# Altium schematic sheet 03_POWER-DISCRETE.SchDoc: =title
size A1; Author: kang jin; Engineer: kang jin; Organization: 六零加智能科技; Address4: www.nidone.com.cn; Revision: 1.0
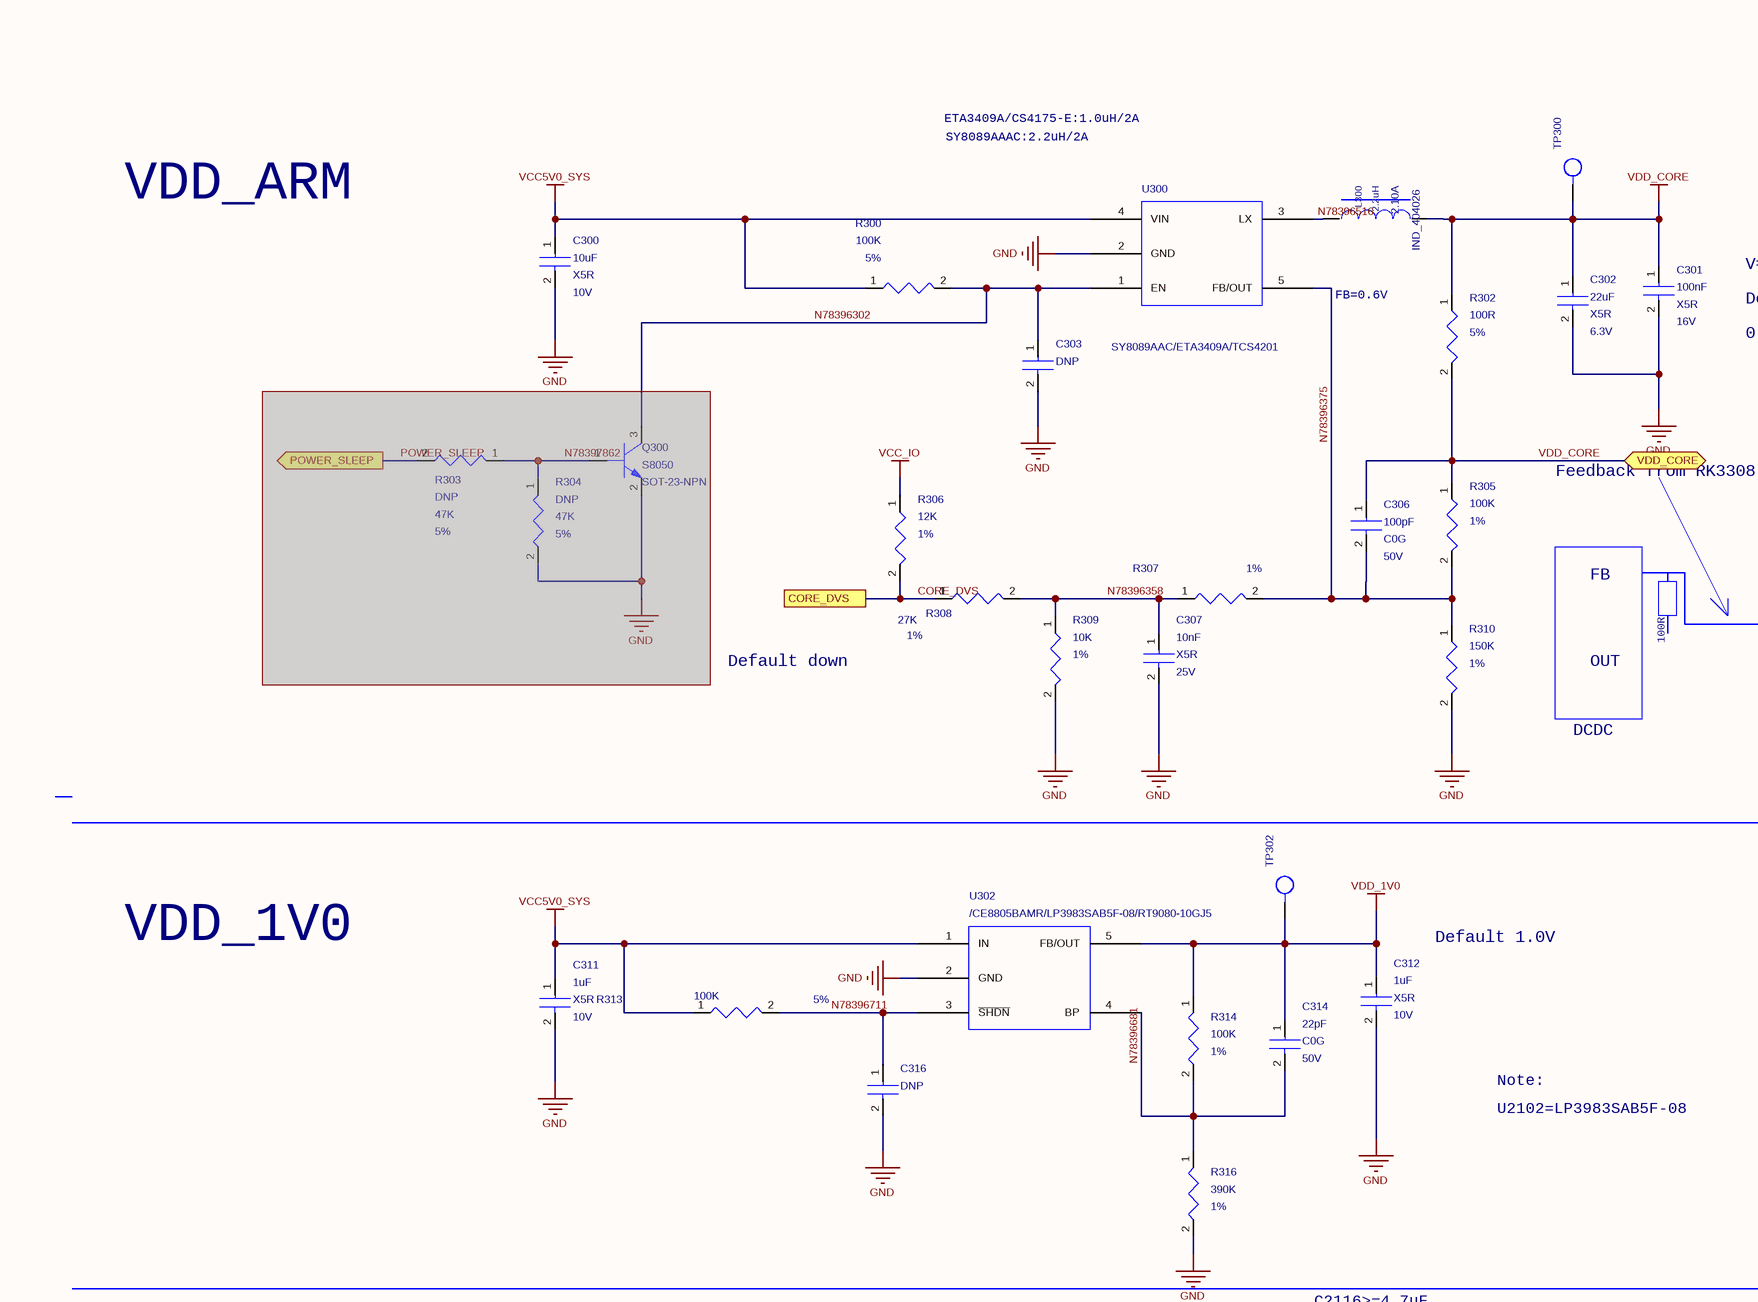
[diagram p0: 03_POWER-DISCRETE.SchDoc, top left]
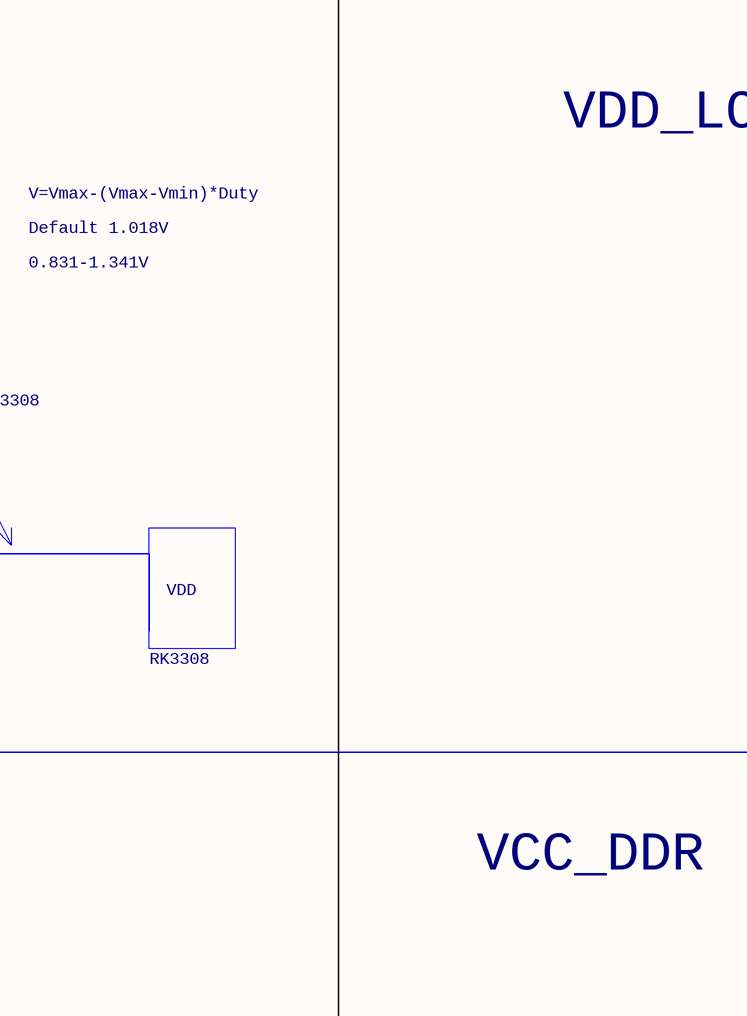
[diagram p1: 03_POWER-DISCRETE.SchDoc, top middle]
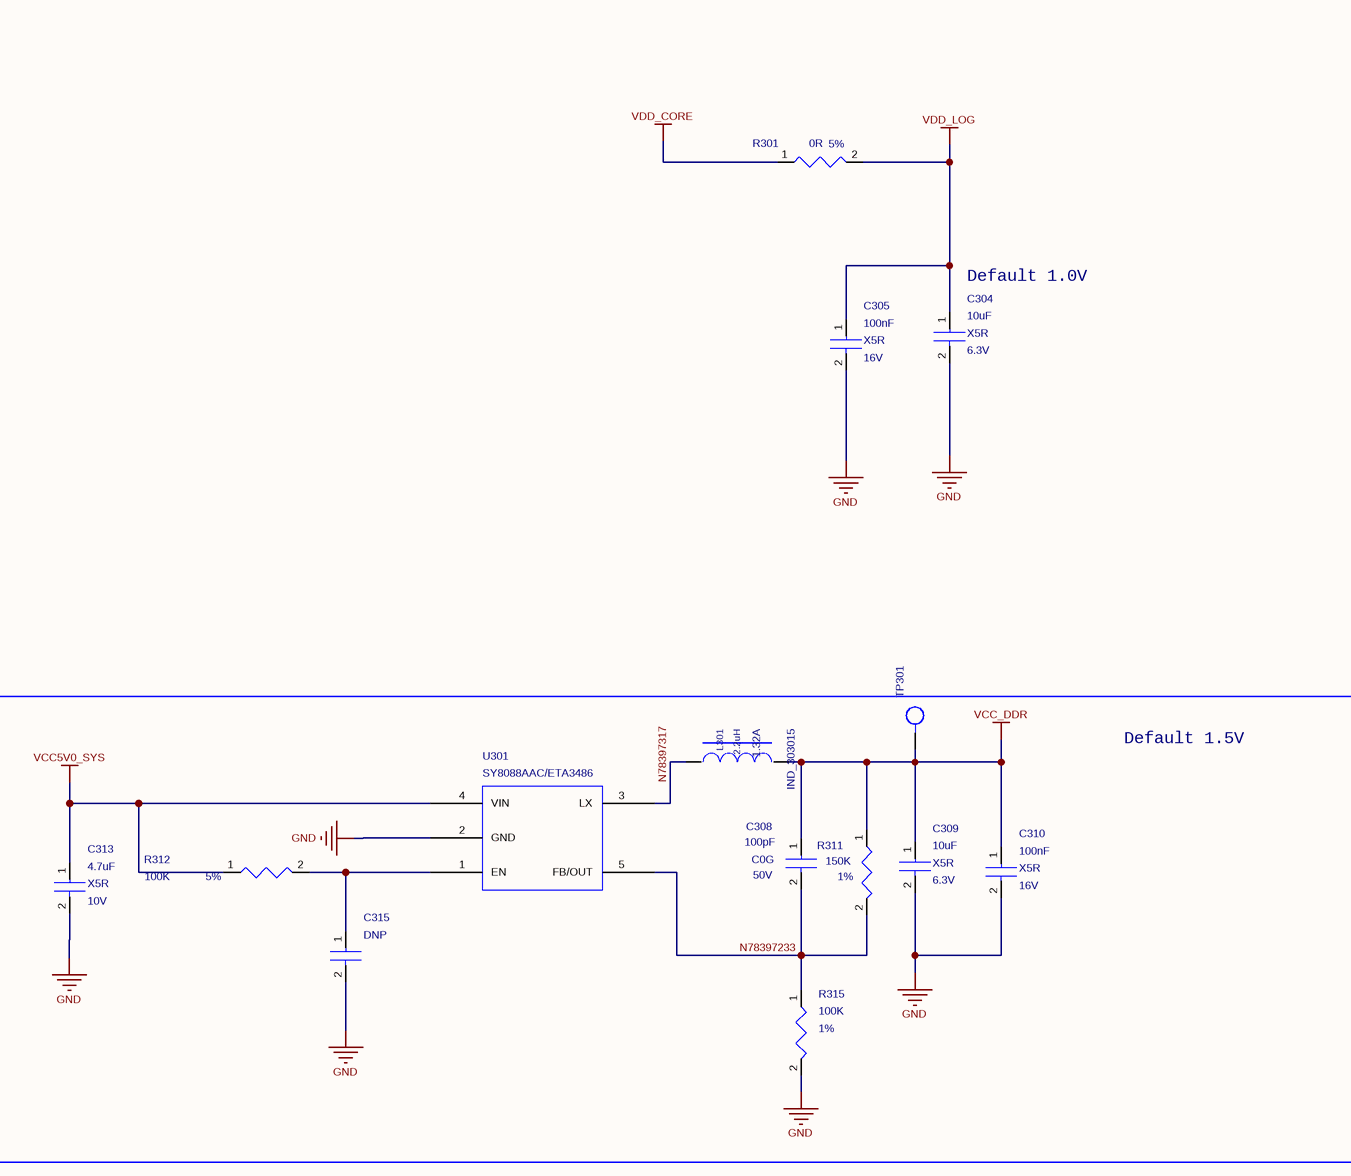
[diagram p2: 03_POWER-DISCRETE.SchDoc, top right]
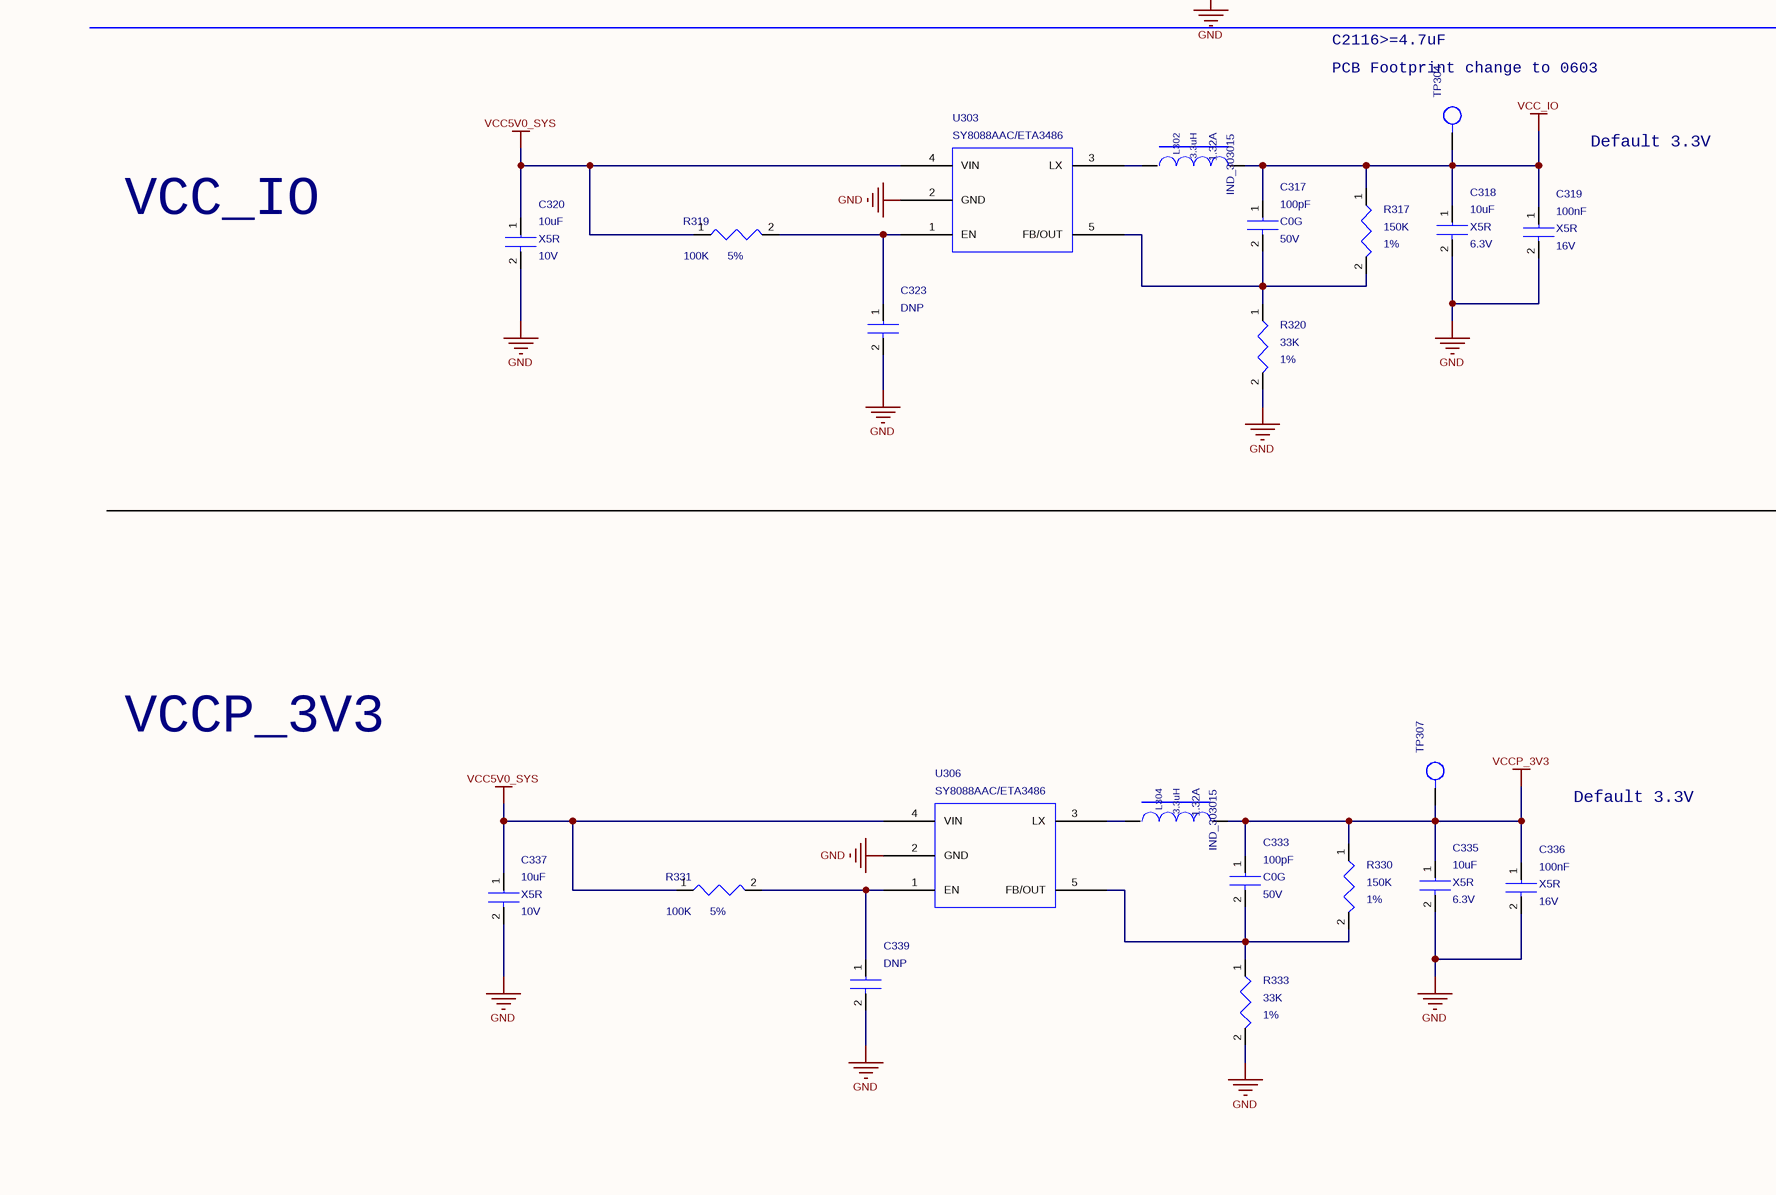
[diagram p3: 03_POWER-DISCRETE.SchDoc, centre left]
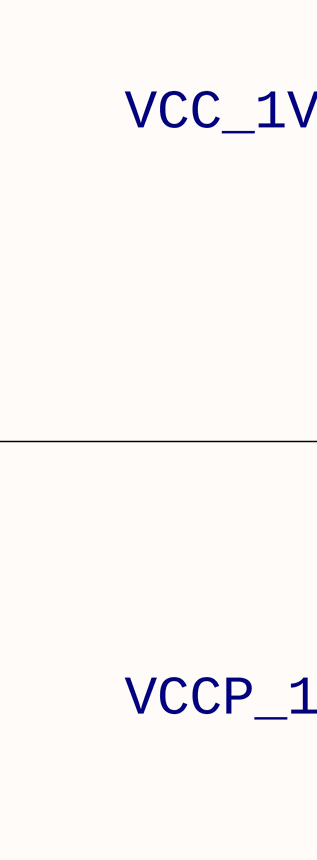
[diagram p4: 03_POWER-DISCRETE.SchDoc, centre middle]
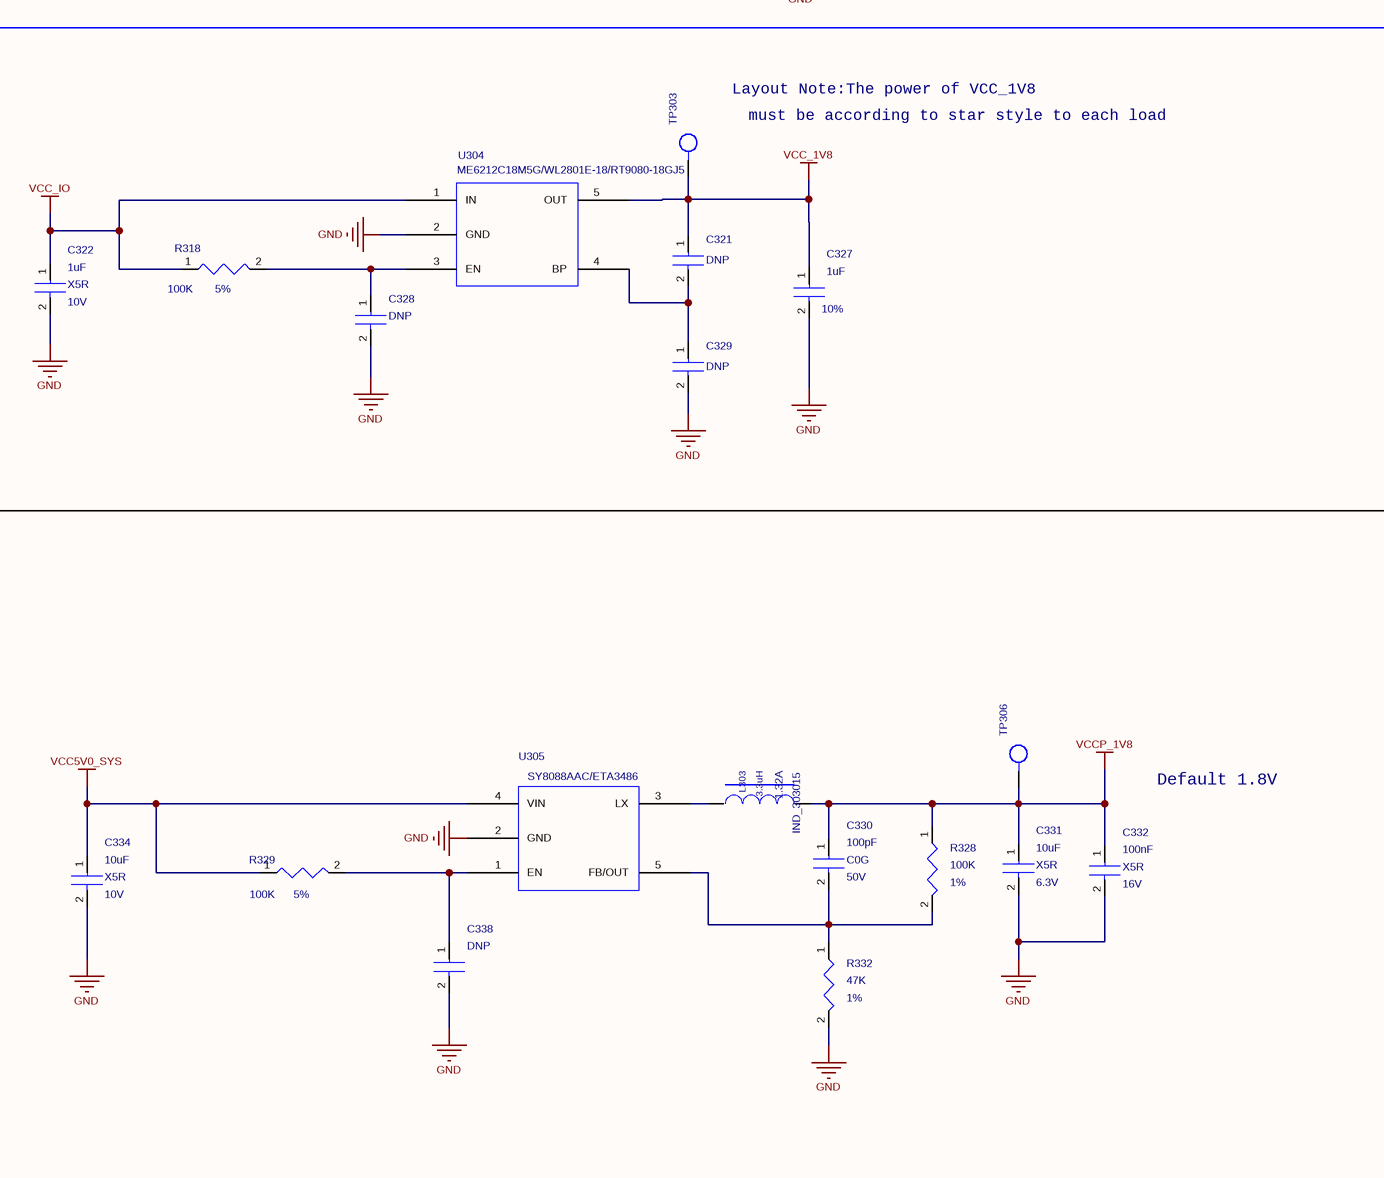
[diagram p5: 03_POWER-DISCRETE.SchDoc, centre right]
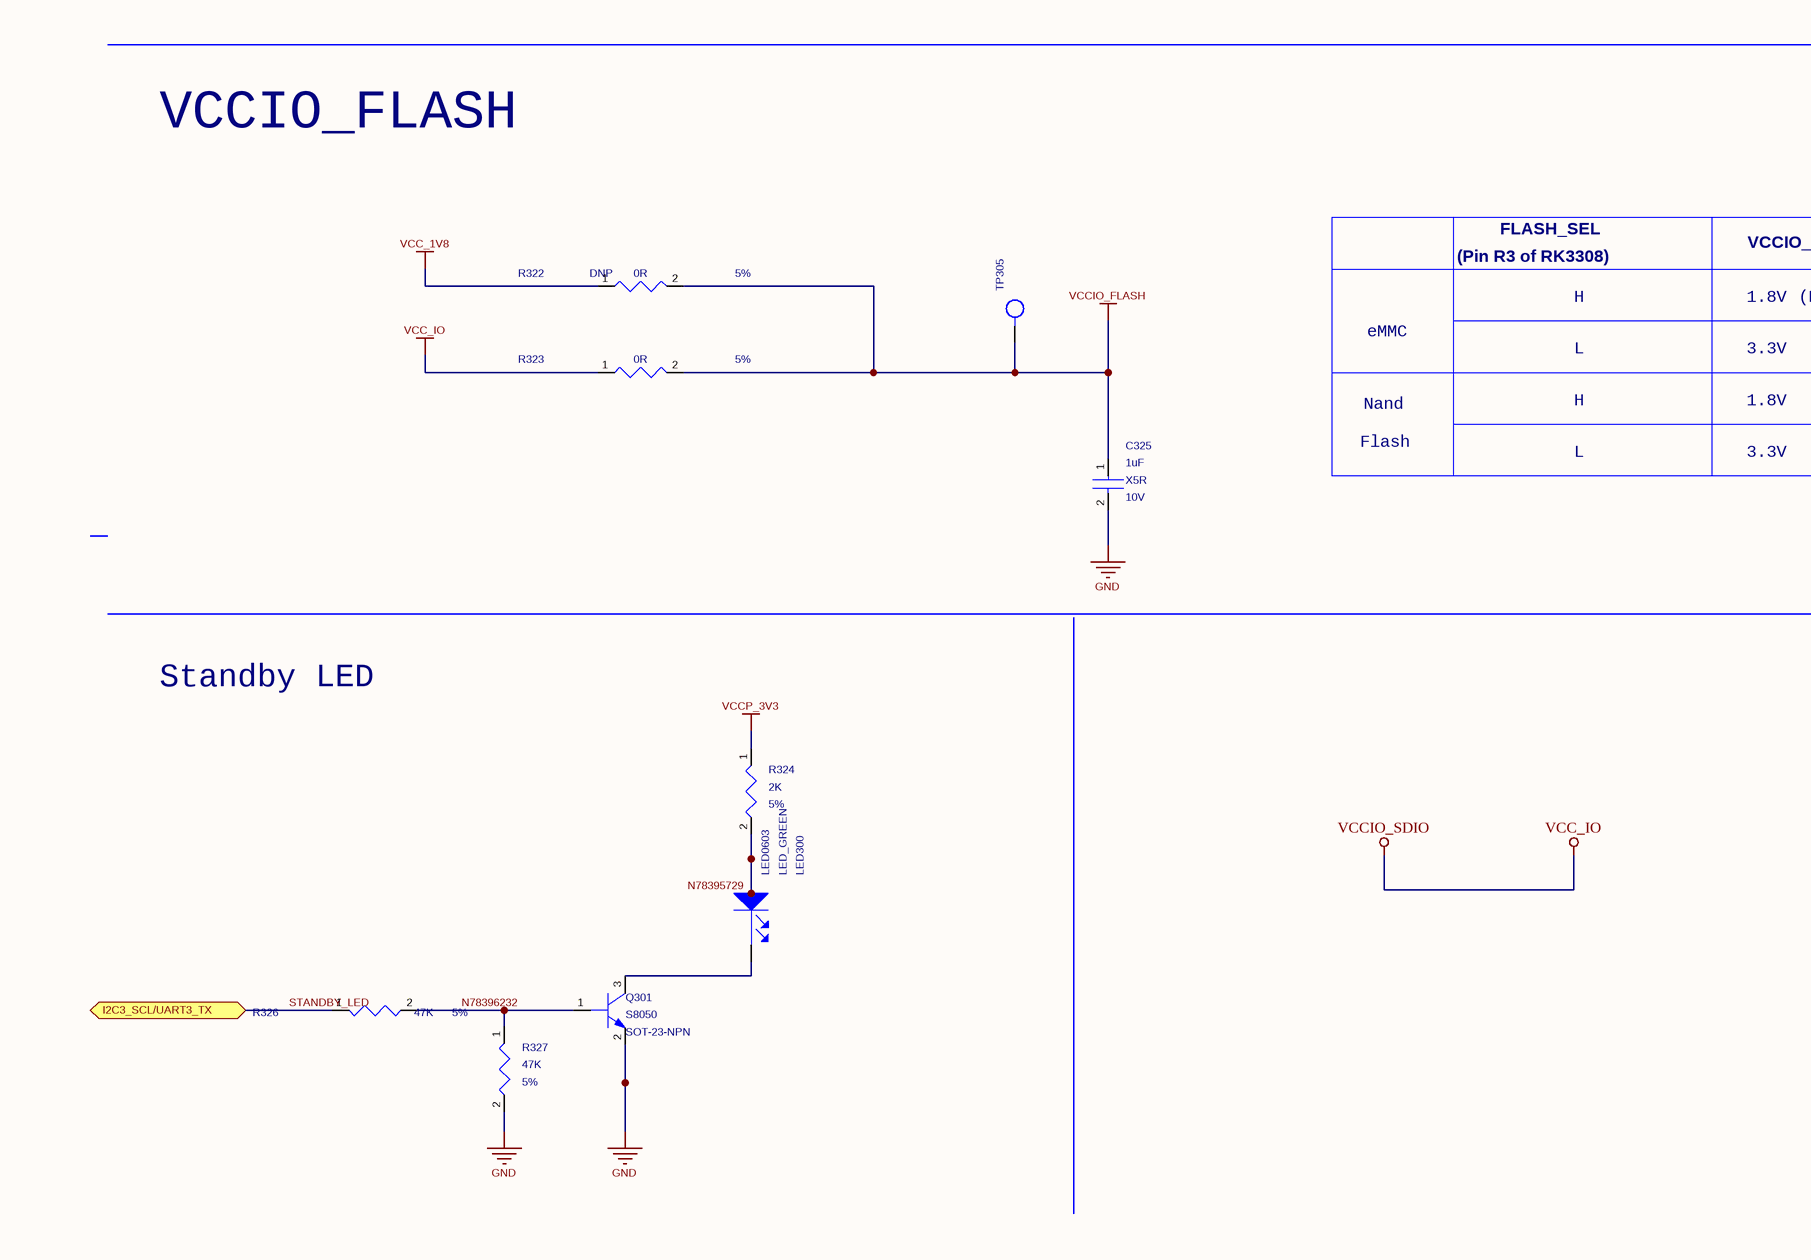
[diagram p6: 03_POWER-DISCRETE.SchDoc, bottom left]
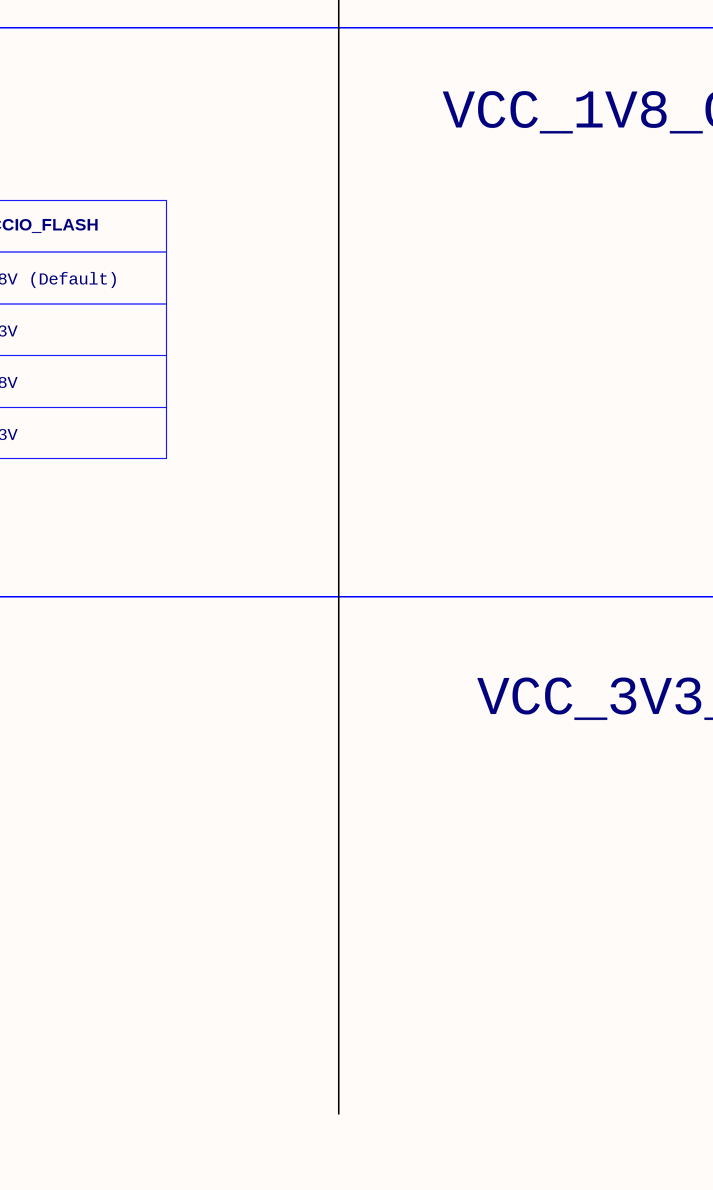
[diagram p7: 03_POWER-DISCRETE.SchDoc, bottom middle]
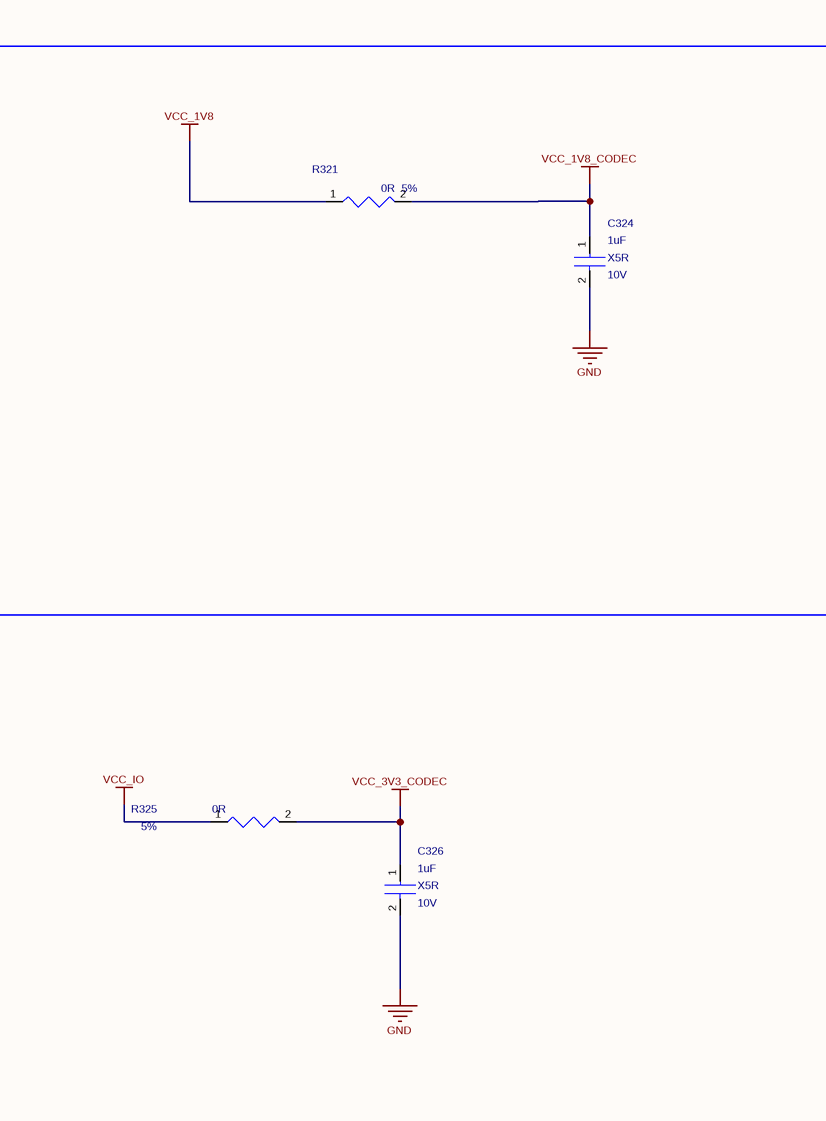
[diagram p8: 03_POWER-DISCRETE.SchDoc, bottom right]

## Parts
C300  value 10uF  Dielectric: X5R  Voltage: 10V  [C0805]  (hidden comment: CAP_NP_2)
C301  value 100nF  Voltage: 16V  Dielectric: X5R  [C0402]  (hidden comment: CAP_NP_2)
C302  value 22uF  Voltage: 6.3V  Dielectric: X5R  [C0603]  (hidden comment: CAP_NP_2)
C303  value DNP  [C0402]  (hidden comment: CAP_NP_2)
C304  value 10uF  Voltage: 6.3V  Dielectric: X5R  [C0603]  (hidden comment: CAP_NP_2)
C305  value 100nF  Dielectric: X5R  Voltage: 16V  [C0402]  (hidden comment: CAP_NP_2)
C306  value 100pF  Voltage: 50V  Dielectric: C0G  [C0402]  (hidden comment: CAP_NP_2)
C307  value 10nF  Dielectric: X5R  Voltage: 25V  [C0402]  (hidden comment: CAP_NP_2)
C308  value 100pF  Voltage: 50V  Dielectric: C0G  [C0402]  (hidden comment: CAP_NP_2)
C309  value 10uF  Voltage: 6.3V  Dielectric: X5R  [C0603]  (hidden comment: CAP_NP_2)
C310  value 100nF  Voltage: 16V  Dielectric: X5R  [C0402]  (hidden comment: CAP_NP_2)
C311  value 1uF  Voltage: 10V  Dielectric: X5R  [C0402]  (hidden comment: CAP_NP_2)
C312  value 1uF  Voltage: 10V  Dielectric: X5R  [C0402]  (hidden comment: CAP_NP_2)
C313  value 4.7uF  Voltage: 10V  Dielectric: X5R  [C0603]  (hidden comment: CAP_NP_2)
C314  value 22pF  Dielectric: C0G  Voltage: 50V  [C0402]  (hidden comment: CAP_NP_2)
C315  value DNP  [C0402]  (hidden comment: CAP_NP_2)
C316  value DNP  [C0402]  (hidden comment: CAP_NP_2)
C317  value 100pF  Dielectric: C0G  Voltage: 50V  [C0402]  (hidden comment: CAP_NP_2)
C318  value 10uF  Voltage: 6.3V  Dielectric: X5R  [C0603]  (hidden comment: CAP_NP_2)
C319  value 100nF  Voltage: 16V  Dielectric: X5R  [C0402]  (hidden comment: CAP_NP_2)
C320  value 10uF  Voltage: 10V  Dielectric: X5R  [C0805]  (hidden comment: CAP_NP_2)
C321  value DNP  [C0402]  (hidden comment: CAP_NP_2)
C322  value 1uF  Voltage: 10V  Dielectric: X5R  [C0402]  (hidden comment: CAP_NP_2)
C323  value DNP  [C0402]  (hidden comment: CAP_NP_2)
C324  value 1uF  Voltage: 10V  Dielectric: X5R  [C0402]  (hidden comment: CAP_NP_2)
C325  value 1uF  Voltage: 10V  Dielectric: X5R  [C0402]  (hidden comment: CAP_NP_2)
C326  value 1uF  Dielectric: X5R  Voltage: 10V  [C0402]  (hidden comment: CAP_NP_2)
C327  value 1uF  Tolerance: 10%  [C0402]  (hidden comment: CAP_NP_2)
C328  value DNP  [C0402]  (hidden comment: CAP_NP_2)
C329  value DNP  [C0402]  (hidden comment: CAP_NP_2)
C330  value 100pF  Dielectric: C0G  Voltage: 50V  [C0402]  (hidden comment: CAP_NP_2)
C331  value 10uF  Voltage: 6.3V  Dielectric: X5R  [C0603]  (hidden comment: CAP_NP_2)
C332  value 100nF  Voltage: 16V  Dielectric: X5R  [C0402]  (hidden comment: CAP_NP_2)
C333  value 100pF  Dielectric: C0G  Voltage: 50V  [C0402]  (hidden comment: CAP_NP_2)
C334  value 10uF  Voltage: 10V  Dielectric: X5R  [C0805]  (hidden comment: CAP_NP_2)
C335  value 10uF  Voltage: 6.3V  Dielectric: X5R  [C0603]  (hidden comment: CAP_NP_2)
C336  value 100nF  Voltage: 16V  Dielectric: X5R  [C0402]  (hidden comment: CAP_NP_2)
C337  value 10uF  Voltage: 10V  Dielectric: X5R  [C0805]  (hidden comment: CAP_NP_2)
C338  value DNP  [C0402]  (hidden comment: CAP_NP_2)
C339  value DNP  [C0402]  (hidden comment: CAP_NP_2)
L300  value 2.2uH  PCB DECAL: IND_404026  Isat: 2.10A  [IND-4X4]  (hidden comment: INDUCTORS_OF_FERRITE)
L301  value 2.2uH  PCB DECAL: IND_303015  Isat: 1.32A  [IND-3X3]  (hidden comment: INDUCTORS_OF_FERRITE)
L302  value 3.3uH  PCB DECAL: IND_303015  Isat: 1.32A  [IND-3X3]  (hidden comment: INDUCTORS_OF_FERRITE)
L303  value 3.3uH  PCB DECAL: IND_303015  Isat: 1.32A  [IND-3X3]  (hidden comment: INDUCTORS_OF_FERRITE)
L304  value 3.3uH  PCB DECAL: IND_303015  Isat: 1.32A  [IND-3X3]  (hidden comment: INDUCTORS_OF_FERRITE)
LED300  value LED_GREEN  PCB DECAL: LED0603  [R0603]  (hidden comment: LED)
Q300  value S8050  [SOT-23-NPN]  (hidden comment: NPN)  (masked out: inside a compile mask, not in the netlist)
Q301  value S8050  PCB DECAL: SOT-23-NPN  [SOT23]  (hidden comment: NPN)
R300  value 100K  Tolerance: 5%  [R0402]  (hidden comment: RESISTOR)
R301  value 0R  Tolerance: 5%  [R0805]  (hidden comment: RESISTOR)
R302  value 100R  Tolerance: 5%  [R0402]  (hidden comment: RESISTOR)
R303  value 47K  OPTION: DNP  Tolerance: 5%  [R0402]  (hidden comment: RESISTOR)  (masked out: inside a compile mask, not in the netlist)
R304  value 47K  Tolerance: 5%  OPTION: DNP  [R0402]  (hidden comment: RESISTOR)  (masked out: inside a compile mask, not in the netlist)
R305  value 100K  Tolerance: 1%  [R0402]  (hidden comment: RESISTOR)
R306  value 12K  Tolerance: 1%  [R0402]  (hidden comment: RESISTOR)
R307  Tolerance: 1%  [R0402]  (hidden comment: RESISTOR)
R308  value 27K  Tolerance: 1%  [R0402]  (hidden comment: RESISTOR)
R309  value 10K  Tolerance: 1%  [R0402]  (hidden comment: RESISTOR)
R310  value 150K  Tolerance: 1%  [R0402]  (hidden comment: RESISTOR)
R311  value 150K  Tolerance: 1%  [R0402]  (hidden comment: RESISTOR)
R312  value 100K  Tolerance: 5%  [R0402]  (hidden comment: RESISTOR)
R313  value 100K  Tolerance: 5%  [R0402]  (hidden comment: RESISTOR)
R314  value 100K  Tolerance: 1%  [R0402]  (hidden comment: RESISTOR)
R315  value 100K  Tolerance: 1%  [R0402]  (hidden comment: RESISTOR)
R316  value 390K  Tolerance: 1%  [R0402]  (hidden comment: RESISTOR)
R317  value 150K  Tolerance: 1%  [R0402]  (hidden comment: RESISTOR)
R318  value 100K  Tolerance: 5%  [R0402]  (hidden comment: RESISTOR)
R319  value 100K  Tolerance: 5%  [R0402]  (hidden comment: RESISTOR)
R320  value 33K  Tolerance: 1%  [R0402]  (hidden comment: RESISTOR)
R321  value 0R  Tolerance: 5%  [R0402]  (hidden comment: RESISTOR)
R322  value 0R  Tolerance: 5%  option: DNP  [R0402]  (hidden comment: RESISTOR)
R323  value 0R  Tolerance: 5%  [R0402]  (hidden comment: RESISTOR)
R324  value 2K  Tolerance: 5%  [R0402]  (hidden comment: RESISTOR)
R325  value 0R  Tolerance: 5%  [R0402]  (hidden comment: RESISTOR)
R326  value 47K  Tolerance: 5%  [R0402]  (hidden comment: RESISTOR)
R327  value 47K  Tolerance: 5%  [R0402]  (hidden comment: RESISTOR)
R328  value 100K  Tolerance: 1%  [R0402]  (hidden comment: RESISTOR)
R329  value 100K  Tolerance: 5%  [R0402]  (hidden comment: RESISTOR)
R330  value 150K  Tolerance: 1%  [R0402]  (hidden comment: RESISTOR)
R331  value 100K  Tolerance: 5%  [R0402]  (hidden comment: RESISTOR)
R332  value 47K  Tolerance: 1%  [R0402]  (hidden comment: RESISTOR)
R333  value 33K  Tolerance: 1%  [R0402]  (hidden comment: RESISTOR)
TP300  TP  [TEST]  (value not drawn)
TP301  TP  [TEST]  (value not drawn)
TP302  TP  [TEST]  (value not drawn)
TP303  TP  [TEST]  (value not drawn)
TP304  TP  [TEST]  (value not drawn)
TP305  TP  [TEST]  (value not drawn)
TP306  TP  [TEST]  (value not drawn)
TP307  TP  [TEST]  (value not drawn)
U300  value SY8089AAC/ETA3409A/TCS4201  [SOT_23_5]  (hidden comment: DCDC_SY8088)
U301  value SY8088AAC/ETA3486  [SOT_23_5]  (hidden comment: DCDC_SY8088)
U302  value /CE8805BAMR/LP3983SAB5F-08/RT9080-10GJ5  [SOT_23_5]  (hidden comment: LDO_TT2102)
U303  value SY8088AAC/ETA3486  [SOT_23_5]  (hidden comment: DCDC_SY8088)
U304  value ME6212C18M5G/WL2801E-18/RT9080-18GJ5  [SOT_23_5]  (hidden comment: LDO_PT5108)
U305  value SY8088AAC/ETA3486  [SOT_23_5]  (hidden comment: DCDC_SY8088)
U306  value SY8088AAC/ETA3486  [SOT_23_5]  (hidden comment: DCDC_SY8088)

## Ports
CORE_DVS, I2C3_SCL/UART3_TX (bidir), POWER_SLEEP (out), VDD_CORE (bidir)

## Nets
GND: C300.2 C301.2 C302.2 C303.2 C304.2 C305.2 C307.2 C309.2 C310.2 C311.2 C312.2 C313.2 C315.2 C316.2 C318.2 C319.2 C320.2 C322.2 C323.2 C324.2 C325.2 C326.2 C327.2 C328.2 C329.2 C331.2 C332.2 C334.2 C335.2 C336.2 C337.2 C338.2 C339.2 Q301.2(EMITTER) R309.2 R310.2 R315.2 R316.2 R320.2 R327.2 R332.2 R333.2 U300.2(GND) U301.2(GND) U302.2(GND) U303.2(GND) U304.2(GND) U305.2(GND) U306.2(GND)
VCC5V0_SYS: C300.1 C311.1 C313.1 C320.1 C334.1 C337.1 R300.1 R312.1 R313.1 R319.1 R329.1 R331.1 U300.4(VIN) U301.4(VIN) U302.1(IN) U303.4(VIN) U305.4(VIN) U306.4(VIN)
VCC_1V8: C321.1 C327.1 R321.1 R322.1 TP303.1 U304.5(OUT)
VCC_1V8_CODEC: C324.1 R321.2
VCC_3V3_CODEC: C326.1 R325.2
VCC_DDR: C308.1 C309.1 C310.1 L301.2 R311.1 TP301.1
VCC_IO: C317.1 C318.1 C319.1 C322.1 L302.2 R306.1 R317.1 R318.1 R323.1 R325.1 TP304.1 U304.1(IN)  [also labelled VCCIO_SDIO]
VCCIO_FLASH: C325.1 R322.2 R323.2 TP305.1
VCCP_1V8: C330.1 C331.1 C332.1 L303.2 R328.1 TP306.1
VCCP_3V3: C333.1 C335.1 C336.1 L304.2 R324.1 R330.1 TP307.1
VDD_1V0: C312.1 C314.1 R314.1 TP302.1 U302.5(FB/OUT)
VDD_CORE: C301.1 C302.1 C306.1 L300.2 R301.1 R302.1 R302.2 R305.1 TP300.1 ; port VDD_CORE
VDD_LOG: C304.1 C305.1 R301.2
CORE_DVS: R306.2 R308.1 ; port CORE_DVS
N78396232: Q301.1(BASE) R326.2 R327.1
N78396302: C303.1 R300.2 U300.1(EN)
N78396358: C307.1 R307.1 R308.2 R309.1
N78396375: C306.2 R305.2 R307.2 R310.1 U300.5(FB/OUT)
N78396516: L300.1 U300.3(LX)
N78396681: C314.2 R314.2 R316.1 U302.4(BP)
N78396711: C316.1 R313.2 U302.3(~{SHDN})
N78397233: C308.2 R311.2 R315.1 U301.5(FB/OUT)
N78397317: L301.1 U301.3(LX)
STANDBY_LED: R326.1 ; port I2C3_SCL/UART3_TX
NetC315_1: C315.1 R312.2 U301.1(EN)
NetC317_2: C317.2 R317.2 R320.1 U303.5(FB/OUT)
NetC321_2: C321.2 C329.1 U304.4(BP)
NetC323_1: C323.1 R319.2 U303.1(EN)
NetC328_1: C328.1 R318.2 U304.3(EN)
NetC330_2: C330.2 R328.2 R332.1 U305.5(FB/OUT)
NetC333_2: C333.2 R330.2 R333.1 U306.5(FB/OUT)
NetC338_1: C338.1 R329.2 U305.1(EN)
NetC339_1: C339.1 R331.2 U306.1(EN)
NetL302_1: L302.1 U303.3(LX)
NetL303_1: L303.1 U305.3(LX)
NetL304_1: L304.1 U306.3(LX)
NetLED300_1: LED300.1(ANODE) R324.2
NetLED300_2: LED300.2(CATHODE) Q301.3(COLLECTOR)

## Notes on the sheet
- ETA3409A/CS4175-E:1.0uH/2A
- SY8089AAAC:2.2uH/2A
- VDD_ARM
- V=Vmax-(Vmax-Vmin)*Duty
- VDD_LOG
- FB=0.6V
- 0.831-1.341V
- Default 1.018V
- (near C304) Default 1.0V
- Feedback from RK3308
- FB
- 100R
- Default down
- OUT
- VDD
- DCDC
- RK3308
- Default 1.5V
- VDD_1V0
- Default 1.0V
- VCC_DDR
- Note:
- U2102=LP3983SAB5F-08
- C2116>=4.7uF
- (near TP304) PCB Footprint change to 0603
- Default 3.3V
- Layout Note:The power of VCC_1V8
- must be according to star style to each load
- VCC_IO
- VCC_1V8
- VCCP_3V3
- VCCP_1V8
- Default 1.8V
- VCCIO_FLASH
- FLASH_SEL
- VCC_1V8_CODEC
- (Pin R3 of RK3308)
- H
- 1.8V
- (Default)
- Nand
- eMMC
- L
- 3.3V
- Flash
- Standby LED
- VCC_3V3_CODEC
- Labels drawn without touching a wire or pin: N78395729
- Title:
- Size:
- Date:
- File:
- A1
- Engineer:
- Time:
- Revision:
- Sheet
- of

## Library data of the parts
C300 = CAP_NP_2: cap,10.00uF,+/-10%,10V,X5R,C0805; Manufacturer: TDK; RK_PN: C2012X5R1A106K085AB; Priority: A; Tolerance: 10%; Created_by: JJJ; Source_Path: Z:\RK_STANDARD_LIBRARY\CADENCE_CIS\RK_DISCRETE.OLB; Number: 1; C_Voltage: 6.3V; PCB DECAL: C0805; Part_Type: C0805; Manufacturer_PN: C2012X5R1A106K085AB
C301 = CAP_NP_2: cap,100.00nF,+/-10%,16V,X5R,C0402; Manufacturer_PN: C1005X5R1C104K050BA; Manufacturer: TDK; Created_by: JJJ; Tolerance: 10%; Priority: A; Source_Path: Z:\RK_STANDARD_LIBRARY\CADENCE_CIS\RK_DISCRETE.OLB; Number: 1; PCB DECAL: C0402; Part_Type: C0402; RK_PN: C1005X5R1C104K050BA
C302 = CAP_NP_2: cap,22.00uF,+/-20%,6.3V,X5R,C0603; Manufacturer_PN: C1608X5R0J226M080AC; Manufacturer: TDK; Created_by: JJJ; Tolerance: 20%; Priority: A; Source_Path: Z:\RK_STANDARD_LIBRARY\CADENCE_CIS\RK_DISCRETE.OLB; number: 1; PCB DECAL: C0603; Part_Type: C0603; RK_PN: C1608X5R0J226M080AC
C303 C316 = CAP_NP_2: Did Not Place.; number: 1; RK_PN: DNP0402; Priority: A; C_Voltage: 6.3V; Created_by: JJJ; Source_Path: Z:\RK_STANDARD_LIBRARY\CADENCE_CIS\RK_DISCRETE.OLB; PCB DECAL: C0402; Option: DNP; Part_Type: DNP; Manufacturer_PN: DNP0402
C304 C309 = CAP_NP_2: cap,10.00uF,+/-10%,6.3V,X5R,C0603; Manufacturer_PN: C1608X5R0J106K080AB; Manufacturer: TDK; Created_by: JJJ; Tolerance: 10%; Priority: A; Source_Path: Z:\RK_STANDARD_LIBRARY\CADENCE_CIS\RK_DISCRETE.OLB; Number: 1; PCB DECAL: C0603; Part_Type: C0603; RK_PN: C1608X5R0J106K080AB
C305 = CAP_NP_2: cap,100.00nF,+/-10%,16V,X5R,C0402; Manufacturer: TDK; RK_PN: C1005X5R1C104K050BA; Priority: A; Tolerance: 10%; Created_by: JJJ; Source_Path: Z:\RK_STANDARD_LIBRARY\CADENCE_CIS\RK_DISCRETE.OLB; Number: 1; PCB DECAL: C0402; Part_Type: C0402; Manufacturer_PN: C1005X5R1C104K050BA
C306 = CAP_NP_2: cap,100.00pF,+/-10%,50V,C0G,C0402; Manufacturer_PN: C1005C0G1H101K050BA; Manufacturer: TDK; Created_by: JJJ; Tolerance: 10%; Priority: A; Source_Path: Z:\RK_STANDARD_LIBRARY\CADENCE_CIS\RK_DISCRETE.OLB; PCB DECAL: C0402; Part_Type: C0402; RK_PN: C1005C0G1H101K050BA
C307 = CAP_NP_2: cap,10.00nF,+/-10%,25V,X5R,C0402; Manufacturer: TDK; RK_PN: C1005X5R1E103K050BA; Priority: A; Tolerance: 10%; Created_by: JJJ; Source_Path: Z:\RK_STANDARD_LIBRARY\CADENCE_CIS\RK_DISCRETE.OLB; PCB DECAL: C0402; Part_Type: C0402; Manufacturer_PN: C1005X5R1E103K050BA
C308 C317 C330 C333 = CAP_NP_2: cap,100.00pF,+/-10%,50V,C0G,C0402; Manufacturer: TDK; Number: 1; RK_PN: C1005C0G1H101K050BA; Priority: A; Tolerance: 10%; C_Voltage: 6.3V; Created_by: JJJ; Source_Path: Z:\RK_STANDARD_LIBRARY\CADENCE_CIS\RK_DISCRETE.OLB; PCB DECAL: C0402; Part_Type: C0402; Manufacturer_PN: C1005C0G1H101K050BA
C310 C319 C332 C336 = CAP_NP_2: cap,100.00nF,+/-10%,16V,X5R,C0402; Manufacturer: TDK; Number: 1; RK_PN: C1005X5R1C104K050BA; Priority: A; Tolerance: 10%; Created_by: JJJ; Source_Path: Z:\RK_STANDARD_LIBRARY\CADENCE_CIS\RK_DISCRETE.OLB; PCB DECAL: C0402; Part_Type: C0402; Manufacturer_PN: C1005X5R1C104K050BA
C311 C312 C322 C326 = CAP_NP_2: cap,1.00uF,+/-10%,10V,X5R,C0402; Manufacturer: TDK; RK_PN: C1005X5R1A105K050BB; Priority: A; C_Voltage: 6.3V; Tolerance: 10%; Created_by: JJJ; Source_Path: Z:\RK_STANDARD_LIBRARY\CADENCE_CIS\RK_DISCRETE.OLB; PCB DECAL: C0402; Part_Type: C0402; Manufacturer_PN: C1005X5R1A105K050BB
C313 = CAP_NP_2: cap,4.70uF,+/-10%,10V,X5R,C0603; Manufacturer_PN: C1608X5R1A475K080AC; Manufacturer: TDK; Created_by: JJJ; Tolerance: 10%; C_Voltage: 6.3V; Priority: A; Source_Path: Z:\RK_STANDARD_LIBRARY\CADENCE_CIS\RK_DISCRETE.OLB; Number: 1; PCB DECAL: C0603; Part_Type: C0603; RK_PN: C1608X5R1A475K080AC
C314 = CAP_NP_2: cap,22.00pF,+/-5%,50V,C0G,C0402; Manufacturer_PN: C1005C0G1H220J050BA; Manufacturer: TDK; Created_by: JJJ; Tolerance: 5%; C_Voltage: 6.3V; Priority: A; Source_Path: Z:\RK_STANDARD_LIBRARY\CADENCE_CIS\RK_DISCRETE.OLB; PCB DECAL: C0402; Part_Type: C0402; RK_PN: C1005C0G1H220J050BA
C315 C323 C338 C339 = CAP_NP_2: Did Not Place.; RK_PN: DNPC0402; Priority: A; Created_by: JJJ; Source_Path: Z:\RK_STANDARD_LIBRARY\CADENCE_CIS\RK_DISCRETE.OLB; number: 1; PCB DECAL: C0402; Part_Type: DNP; Manufacturer_PN: DNPC0402; Option: DNP
C318 C331 C335 = CAP_NP_2: cap,10.00uF,+/-10%,6.3V,X5R,C0603; Manufacturer: TDK; RK_PN: C1608X5R0J106K080AB; Priority: A; Tolerance: 10%; Created_by: JJJ; Source_Path: Z:\RK_STANDARD_LIBRARY\CADENCE_CIS\RK_DISCRETE.OLB; Number: 1; PCB DECAL: C0603; Part_Type: C0603; C_Voltage: 6.3V; Manufacturer_PN: C1608X5R0J106K080AB
C320 C334 C337 = CAP_NP_2: cap,10.00uF,+/-10%,10V,X5R,C0805; Manufacturer: TDK; RK_PN: C2012X5R1A106K085AB; Priority: A; C_Voltage: 6.3V; Tolerance: 10%; Created_by: JJJ; Source_Path: Z:\RK_STANDARD_LIBRARY\CADENCE_CIS\RK_DISCRETE.OLB; Number: 1; PCB DECAL: C0805; Part_Type: C0805; Manufacturer_PN: C2012X5R1A106K085AB
C321 C329 = CAP_NP_2: Did Not Place.; Manufacturer_PN: DNP0402; Created_by: JJJ; Priority: A; Source_Path: Z:\RK_STANDARD_LIBRARY\CADENCE_CIS\RK_DISCRETE.OLB; number: 1; PCB DECAL: C0402; Part_Type: DNP; RK_PN: DNP0402; Option: DNP
C324 C325 = CAP_NP_2: cap,1.00uF,+/-10%,10V,X5R,C0402; Manufacturer_PN: C1005X5R1A105K050BB; Manufacturer: TDK; Created_by: JJJ; Tolerance: 10%; C_Voltage: 6.3V; Priority: A; Source_Path: Z:\RK_STANDARD_LIBRARY\CADENCE_CIS\RK_DISCRETE.OLB; PCB DECAL: C0402; Part_Type: C0402; RK_PN: C1005X5R1A105K050BB
C327 = CAP_NP_2: cap,1.00uF,+/-10%,10V,X5R,C0402; Manufacturer_PN: C1005X5R1A105K050BB; Manufacturer: TDK; Created_by: JJJ; C_Voltage: 6.3V; Priority: A; Source_Path: Z:\RK_STANDARD_LIBRARY\CADENCE_CIS\RK_DISCRETE.OLB; PCB DECAL: C0402; Voltage: 10V; Dielectric: X5R; Part_Type: C0402; RK_PN: C1005X5R1A105K050BB
C328 = CAP_NP_2: Did Not Place.; Manufacturer_PN: DNP0402; Created_by: JJJ; C_Voltage: 6.3V; Priority: A; number: 1; Source_Path: Z:\RK_STANDARD_LIBRARY\CADENCE_CIS\RK_DISCRETE.OLB; PCB DECAL: C0402; Part_Type: DNP; RK_PN: DNP0402; Option: DNP
L300 = INDUCTORS_OF_FERRITE: Power Inductor,2.2uH,0.2,IND_404026; Manufacturer_PN: SWPA4026S2R2MT; Manufacturer: sunlord; Part_Type: POWER_IND; Created_by: YTL; Resonace_frequency: 96M; Irms: 2A; Tolerance: 20%; DC_Resistor: 0.04ohm; Priority: A; Source_Path: Z:\RK_STANDARD_LIBRARY\CADENCE_CIS\RK_DISCRETE.OLB; RK_PN: SWPA4026S2R2MT
L301 = INDUCTORS_OF_FERRITE: Power Inductor,3.3uH,0.2,IND_303015; Part_Type: POWER_IND; Manufacturer: sunlord; RK_PN: SWPA3015S3R3MT; Priority: A; DC_Resistor: 0.04ohm; Tolerance: 20%; Irms: 1.36A; Resonace_frequency: 96M; Created_by: YTL; Source_Path: Z:\RK_STANDARD_LIBRARY\CADENCE_CIS\RK_DISCRETE.OLB; Manufacturer_PN: SWPA3015S3R3MT
L302-L304 = INDUCTORS_OF_FERRITE: Power Inductor,3.3uH,0.2,IND_303015; Manufacturer_PN: SWPA3015S3R3MT; Manufacturer: sunlord; Part_Type: POWER_IND; Created_by: YTL; Resonace_frequency: 96M; Irms: 1.36A; Tolerance: 20%; DC_Resistor: 0.04ohm; Priority: A; Source_Path: Z:\RK_STANDARD_LIBRARY\CADENCE_CIS\RK_DISCRETE.OLB; RK_PN: SWPA3015S3R3MT
LED300 = LED: 贴片LED灯，0603，绿色; Created_by: JJJ; Priority: A; Source_Path: Z:\RK_STANDARD_LIBRARY\CADENCE_CIS\RK_DISCRETE.OLB; Part_Type: LED; RK_PN: LED_GREEN
Q300 Q301 = NPN: S8050,SOT23; Manufacturer_PN: S8050_SOT23; Manufacturer: 长电; Created_by: JJJ; Pc: 0.3W; Vceo: 25V; Ic: 0.5A; Priority: A; Source_Path: Z:\RK_STANDARD_LIBRARY\CADENCE_CIS\RK_DISCRETE.OLB; Number: 1; Geometry.Height: 1.100mm; Part_Type: NPN; RK_PN: S8050
  Q300: PCB DECAL: SOT-23-NPN
R300 R312 R319 R329 R331 = RESISTOR: ?用厚膜电阻,100K,+/-5%,R0402,1/16W.; Manufacturer_PN: RC0402JR-07100KL; Manufacturer: YAGEO; Created_by: YTL; Wattage: 1/16W; Priority: A; Source_Path: Z:\RK_STANDARD_LIBRARY\CADENCE_CIS\RK_DISCRETE.OLB; Number: 1; PCB DECAL: R0402; Part_Type: ?用厚膜电阻; RK_PN: RC0402JR-07100KL
R301 = RESISTOR: ?用厚膜电阻,0R,+/-5%,R0805,1/8W.; Manufacturer_PN: RC0805JR-070RL; Manufacturer: YAGEO; Created_by: YTL; Wattage: 1/8W; Priority: A; Source_Path: Z:\RK_STANDARD_LIBRARY\CADENCE_CIS\RK_DISCRETE.OLB; Number: 1; PCB DECAL: R0805; Part_Type: ?用厚膜电阻; RK_PN: RC0805JR-070RL
R302 = RESISTOR: ?用厚膜电阻,100R,+/-5%,R0402,1/16W.; Manufacturer_PN: RC0402JR-07100RL; Manufacturer: YAGEO; Created_by: YTL; Wattage: 1/16W; Priority: A; Source_Path: Z:\RK_STANDARD_LIBRARY\CADENCE_CIS\RK_DISCRETE.OLB; PCB DECAL: R0402; Part_Type: ?用厚膜电阻; RK_PN: RC0402JR-07100RL
R303 R304 R327 = RESISTOR: ?用厚膜电阻,47K,+/-5%,R0402,1/16W.; Manufacturer: YAGEO; RK_PN: RC0402JR-0747KL; Priority: A; Wattage: 1/16W; Created_by: YTL; Source_Path: Z:\RK_STANDARD_LIBRARY\CADENCE_CIS\RK_DISCRETE.OLB; PCB DECAL: R0402; Part_Type: ?用厚膜电阻; Manufacturer_PN: RC0402JR-0747KL
R305 R314 = RESISTOR: ?用厚膜电阻,100K,+/-1%,R0402,1/16W.; Manufacturer_PN: RC0402FR-07100KL; Manufacturer: YAGEO; Created_by: YTL; Wattage: 1/16W; Priority: A; Source_Path: Z:\RK_STANDARD_LIBRARY\CADENCE_CIS\RK_DISCRETE.OLB; PCB DECAL: R0402; Part_Type: ?用厚膜电阻; RK_PN: RC0402FR-07100KL
R306 = RESISTOR: ?用厚膜电阻,12K,+/-1%,R0402,1/16W.; Manufacturer_PN: RC0402FR-0712KL; Manufacturer: YAGEO; Created_by: YTL; Wattage: 1/16W; Priority: A; Source_Path: Z:\RK_STANDARD_LIBRARY\CADENCE_CIS\RK_DISCRETE.OLB; PCB DECAL: R0402; Part_Type: ?用厚膜电阻; RK_PN: RC0402FR-0712KL
R307 = RESISTOR: ?用厚膜电阻,169K,+/-1%,R0402,1/16W.; Manufacturer: YAGEO; RK_PN: RC0402FR-07169KL; Priority: A; Wattage: 1/16W; Created_by: YTL; Source_Path: Z:\RK_STANDARD_LIBRARY\CADENCE_CIS\RK_DISCRETE.OLB; PCB DECAL: R0402; Part_Type: ?用厚膜电阻; Manufacturer_PN: RC0402FR-07169KL
R308 = RESISTOR: ?用厚膜电阻,27K,+/-1%,R0402,1/16W.; Manufacturer_PN: RC0402FR-0727KL; Manufacturer: YAGEO; Created_by: YTL; Wattage: 1/16W; Priority: A; Source_Path: Z:\RK_STANDARD_LIBRARY\CADENCE_CIS\RK_DISCRETE.OLB; PCB DECAL: R0402; Part_Type: ?用厚膜电阻; RK_PN: RC0402FR-0727KL
R309 = RESISTOR: ?用厚膜电阻,10K,+/-1%,R0402,1/16W.; Manufacturer: YAGEO; RK_PN: RC0402FR-0710KL; Priority: A; Wattage: 1/16W; Created_by: YTL; Source_Path: Z:\RK_STANDARD_LIBRARY\CADENCE_CIS\RK_DISCRETE.OLB; PCB DECAL: R0402; Part_Type: ?用厚膜电阻; Manufacturer_PN: RC0402FR-0710KL
R310 R317 R330 = RESISTOR: ?用厚膜电阻,150K,+/-1%,R0402,1/16W.; Manufacturer_PN: RC0402FR-07150KL; Manufacturer: YAGEO; Created_by: YTL; Wattage: 1/16W; Priority: A; Source_Path: Z:\RK_STANDARD_LIBRARY\CADENCE_CIS\RK_DISCRETE.OLB; PCB DECAL: R0402; Part_Type: ?用厚膜电阻; RK_PN: RC0402FR-07150KL
R311 = RESISTOR: ?用厚膜电阻,150K,+/-1%,R0402,1/16W.; Manufacturer: YAGEO; RK_PN: RC0402FR-07150KL; Priority: A; Wattage: 1/16W; Created_by: YTL; Source_Path: Z:\RK_STANDARD_LIBRARY\CADENCE_CIS\RK_DISCRETE.OLB; PCB DECAL: R0402; Part_Type: ?用厚膜电阻; Manufacturer_PN: RC0402FR-07150KL
R313 R318 = RESISTOR: ?用厚膜电阻,100K,+/-5%,R0402,1/16W.; Manufacturer: YAGEO; RK_PN: RC0402JR-07100KL; Priority: A; Wattage: 1/16W; Created_by: YTL; Source_Path: Z:\RK_STANDARD_LIBRARY\CADENCE_CIS\RK_DISCRETE.OLB; Number: 1; PCB DECAL: R0402; Part_Type: ?用厚膜电阻; Manufacturer_PN: RC0402JR-07100KL
R315 = RESISTOR: ?用厚膜电阻,100K,+/-1%,R0402,1/16W.; Manufacturer: YAGEO; RK_PN: RC0402FR-07100KL; Priority: A; Wattage: 1/16W; Created_by: YTL; Source_Path: Z:\RK_STANDARD_LIBRARY\CADENCE_CIS\RK_DISCRETE.OLB; PCB DECAL: R0402; Part_Type: ?用厚膜电阻; Manufacturer_PN: RC0402FR-07100KL
R316 = RESISTOR: ?用厚膜电阻,390K,+/-1%,R0402,1/16W.; Manufacturer: YAGEO; RK_PN: RC0402FR-07390KL; Priority: A; Wattage: 1/16W; Created_by: YTL; Source_Path: Z:\RK_STANDARD_LIBRARY\CADENCE_CIS\RK_DISCRETE.OLB; PCB DECAL: R0402; Part_Type: ?用厚膜电阻; Manufacturer_PN: RC0402FR-07390KL
R320 R333 = RESISTOR: ?用厚膜电阻,33K,+/-1%,R0402,1/16W.; Manufacturer_PN: RC0402FR-0733KL; Manufacturer: YAGEO; Created_by: YTL; Wattage: 1/16W; Priority: A; Source_Path: Z:\RK_STANDARD_LIBRARY\CADENCE_CIS\RK_DISCRETE.OLB; PCB DECAL: R0402; Part_Type: ?用厚膜电阻; RK_PN: RC0402FR-0733KL
R321-R323 R325 = RESISTOR: ?用厚膜电阻,0R,+/-5%,R0402,1/16W.; Manufacturer: YAGEO; RK_PN: RC0402JR-070RL; Priority: A; Wattage: 1/16W; Created_by: YTL; Source_Path: Z:\RK_STANDARD_LIBRARY\CADENCE_CIS\RK_DISCRETE.OLB; Number: 1; PCB DECAL: R0402; Part_Type: ?用厚膜电阻; Manufacturer_PN: RC0402JR-070RL
R324 = RESISTOR: ?用厚膜电阻,2K,+/-5%,R0402,1/16W.; Manufacturer: YAGEO; RK_PN: RC0402JR-072KL; Priority: A; Wattage: 1/16W; Created_by: YTL; Source_Path: Z:\RK_STANDARD_LIBRARY\CADENCE_CIS\RK_DISCRETE.OLB; PCB DECAL: R0402; Part_Type: ?用厚膜电阻; Manufacturer_PN: RC0402JR-072KL
R326 = RESISTOR: ?用厚膜电阻,47K,+/-5%,R0402,1/16W.; Manufacturer_PN: RC0402JR-0747KL; Manufacturer: YAGEO; Created_by: YTL; Wattage: 1/16W; Priority: A; Source_Path: Z:\RK_STANDARD_LIBRARY\CADENCE_CIS\RK_DISCRETE.OLB; PCB DECAL: R0402; Part_Type: ?用厚膜电阻; RK_PN: RC0402JR-0747KL
R328 = RESISTOR: ?用厚膜电阻,100K,+/-1%,R0402,1/16W.; Manufacturer_PN: RC0402FR-07150KL; Manufacturer: YAGEO; Created_by: YTL; Wattage: 1/16W; Priority: A; Source_Path: Z:\RK_STANDARD_LIBRARY\CADENCE_CIS\RK_DISCRETE.OLB; PCB DECAL: R0402; Part_Type: ?用厚膜电阻; RK_PN: RC0402FR-07150KL
R332 = RESISTOR: ?用厚膜电阻,47K,+/-1%,R0402,1/16W.; Manufacturer_PN: RC0402FR-0733KL; Manufacturer: YAGEO; Created_by: YTL; Wattage: 1/16W; Priority: A; Source_Path: Z:\RK_STANDARD_LIBRARY\CADENCE_CIS\RK_DISCRETE.OLB; PCB DECAL: R0402; Part_Type: ?用厚膜电阻; RK_PN: RC0402FR-0733KL
TP300-TP307 = TP: PCB DECAL: PAD_10; reserve: DEPOP; Source_Path: Z:\CAPTURE_CIS\REFERENCE\SYMBOL\TP.OLB; Option: DNP
U300 = DCDC_SY8088: High Efficiency 5.5V, 2A continuous, 3A peak, 1MHz Synchronous Step Down Regulator; Part_Type: DCDC; Manufacturer: Silergy(矽力杰）; RK_PN: SY8089AAC; Priority: A; Created_by: JJJ; Source_Path: Z:\RK_STANDARD_LIBRARY\CADENCE_CIS\RK_IC.OLB; Number: 1; PCB DECAL: SOT_23_5; Manufacturer_PN: SY8089AAC
U301 = DCDC_SY8088: SY8088AAC; Part_Type: DCDC; Manufacturer: Silergy(矽力杰）; Created_by: JJJ; Priority: A; Source_Path: Z:\RK_STANDARD_LIBRARY\CADENCE_CIS\RK_IC.OLB; Number: 1; PCB DECAL: SOT_23_5; Manufacturer_PN: SY8088AAC; RK_PN: SY8088AAC
U302 = LDO_TT2102: LDO,1.5V to 6V input,600mA adj out; Manufacturer_PN: LM8805SF5-ADJ; Created_by: JJJ; Priority: A; RK_PN: TT2102; Source_Path: Z:\RK_STANDARD_LIBRARY\CADENCE_CIS\RK_IC.OLB; Number: 1; PCB DECAL: SOT_23_5; Part_Type: LDO
U303 U305 U306 = DCDC_SY8088: SY8088AAC; Manufacturer: Silergy(矽力杰）; Part_Type: DCDC; Priority: A; Created_by: JJJ; Source_Path: Z:\RK_STANDARD_LIBRARY\CADENCE_CIS\RK_IC.OLB; Number: 1; PCB DECAL: SOT_23_5; RK_PN: SY8088AAC; Manufacturer_PN: SY8088AAC
U304 = LDO_PT5108: High-PSRR 600mA LDO.Output1.8V.; Part_Type: LDO; Manufacturer: Powtech(华润矽威）; RK_PN: ME6212C18M5G; Priority: A; Created_by: JJJ; Source_Path: Z:\RK_STANDARD_LIBRARY\CADENCE_CIS\RK_IC.OLB; Number: 1; PCB DECAL: SOT_23_5; Manufacturer_PN: ME6212C18M5G